# EAGLE schematic HackHarder (EAGLE 7.5.0)
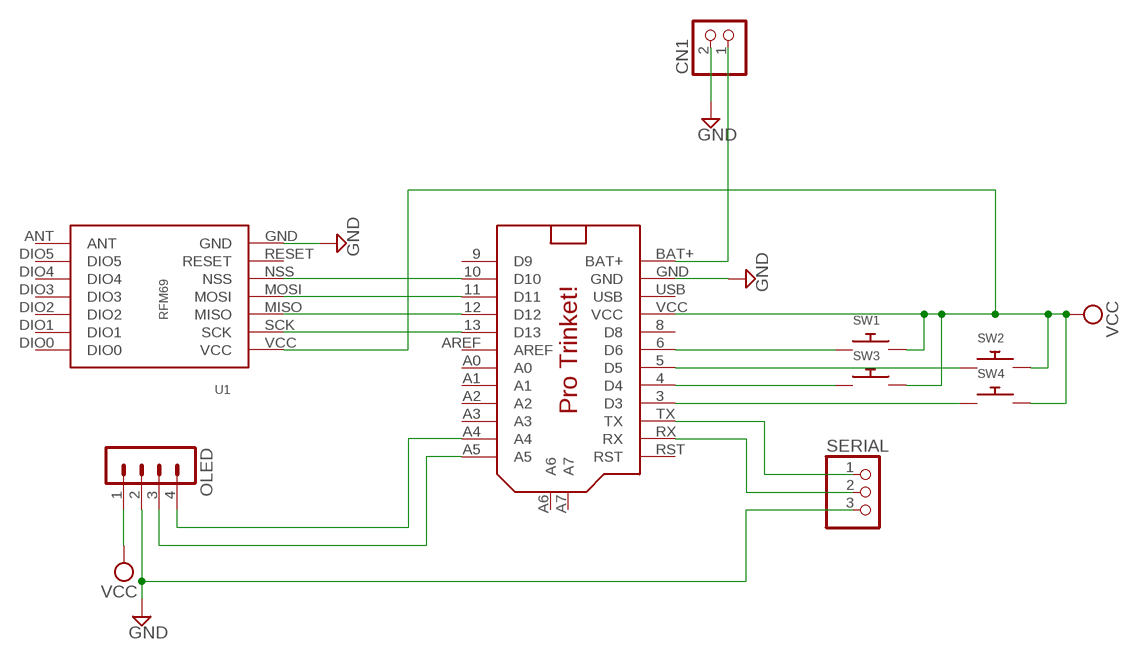
[diagram p0: schematic, sheet 1]

## Parts
CN1  JST_2PIN-SMT-RA  [JST-PH-2-SMT-RA]
MCU1  PRO_TRINKET  [PROTRINKET]
OLED  MA04-1  [MA04-1]
SERIAL  PINHD-1X3  [1X03]
SW1  SWITCH_PUSHBUTTONEVQ-PE  [TACT_PANA-EVQ]
SW2  SWITCH_PUSHBUTTONEVQ-PE  [TACT_PANA-EVQ]
SW3  SWITCH_PUSHBUTTONEVQ-PE  [TACT_PANA-EVQ]
SW4  SWITCH_PUSHBUTTONEVQ-PE  [TACT_PANA-EVQ]
U1  RFM69HW  [RFM69_PADS]

## Nets
G$1: CN1.2 MCU1.GND OLED.2 SERIAL.3 U1.GND ; supply symbol labelled GND
N$2: CN1.1 MCU1.BAT+
N$3: MCU1.A5 OLED.3
N$4: MCU1.A4 OLED.4
N$5: MCU1.11(D11) U1.MOSI
N$6: MCU1.12(D12) U1.MISO
N$7: MCU1.13(D13) U1.SCK
N$8: MCU1.10(D10) U1.NSS
N$12: MCU1.6(D6) SW1.P$1
N$13: MCU1.5(D5) SW2.P$1
N$14: MCU1.4(D4) SW3.P$1
N$15: MCU1.3(D3) SW4.P$1
N$16: MCU1.TX SERIAL.1
N$17: MCU1.RX SERIAL.2
VCC: MCU1.VCC OLED.1 SW1.P$2 SW2.P$2 SW3.P$2 SW4.P$2 U1.VCC
Unconnected: MCU1.8(D8) MCU1.9(D9) MCU1.A0 MCU1.A1 MCU1.A2 MCU1.A3 MCU1.A6 MCU1.A7 MCU1.AREF MCU1.RST U1.ANT U1.DIO0 U1.DIO1 U1.DIO2 U1.DIO3 U1.DIO4 U1.DIO5 U1.RESET

## Power pins joined to a net without a drawn wire
USB: MCU1.USB

## Library data of the parts
CN1 = adafruit:JST_2PIN: JST 2-Pin Connectors of various flavors SMT-RA (S2B-PH-SM4) 4UConnector #17311 SMT (B2B-PH-SM4) THM-RA (S2B-PH) THM (B2B-PH)
MCU1 = adafruit:PRO_TRINKET
OLED = con-lstb:MA04-1: PIN HEADER; OC_FARNELL: unknown; OC_NEWARK: unknown
SERIAL = adafruit:PINHD-1X3: PIN HEADER
SW1-SW4 = adafruit:SWITCH_PUSHBUTTON: Buttons SOFTTOUCHSMD_SJ - Soft touch temporary push button (Super Junk Akihabara) Compatible with SKPMANE010 [Mouser: 688-SKPMAN] C&K_KSS = Digikey: KSS221GLFS
U1 = HopeRF-RFMxx:RFM69HW